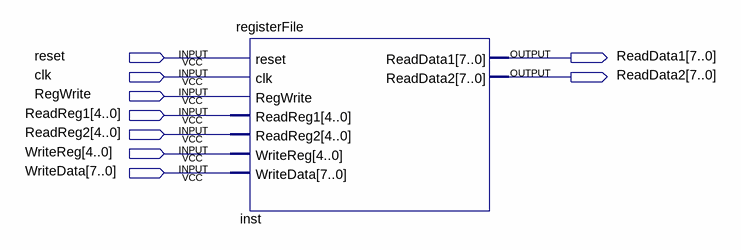
[diagram p0: schematic sheet]
// Quartus schematic REGFILETEST.bdf as structural Verilog: 1 symbols, 9 pins
module REGFILETEST (
  input  reset,
  input  clk,
  input  RegWrite,
  input  [4:0] ReadReg1,
  input  [4:0] ReadReg2,
  input  [4:0] WriteReg,
  input  [7:0] WriteData,
  output [7:0] ReadData1,
  output [7:0] ReadData2
);

  registerFile inst (
    .reset(reset), .clk(clk), .RegWrite(RegWrite), .ReadReg1(ReadReg1), .ReadReg2(ReadReg2),
    .WriteReg(WriteReg), .WriteData(WriteData), .ReadData1(ReadData1), .ReadData2(ReadData2));
endmodule
